# Altium schematic sheet PortSwitch.SchDoc
size A4; DocumentNumber: 1; SheetNumber: 5; SheetTotal: 7
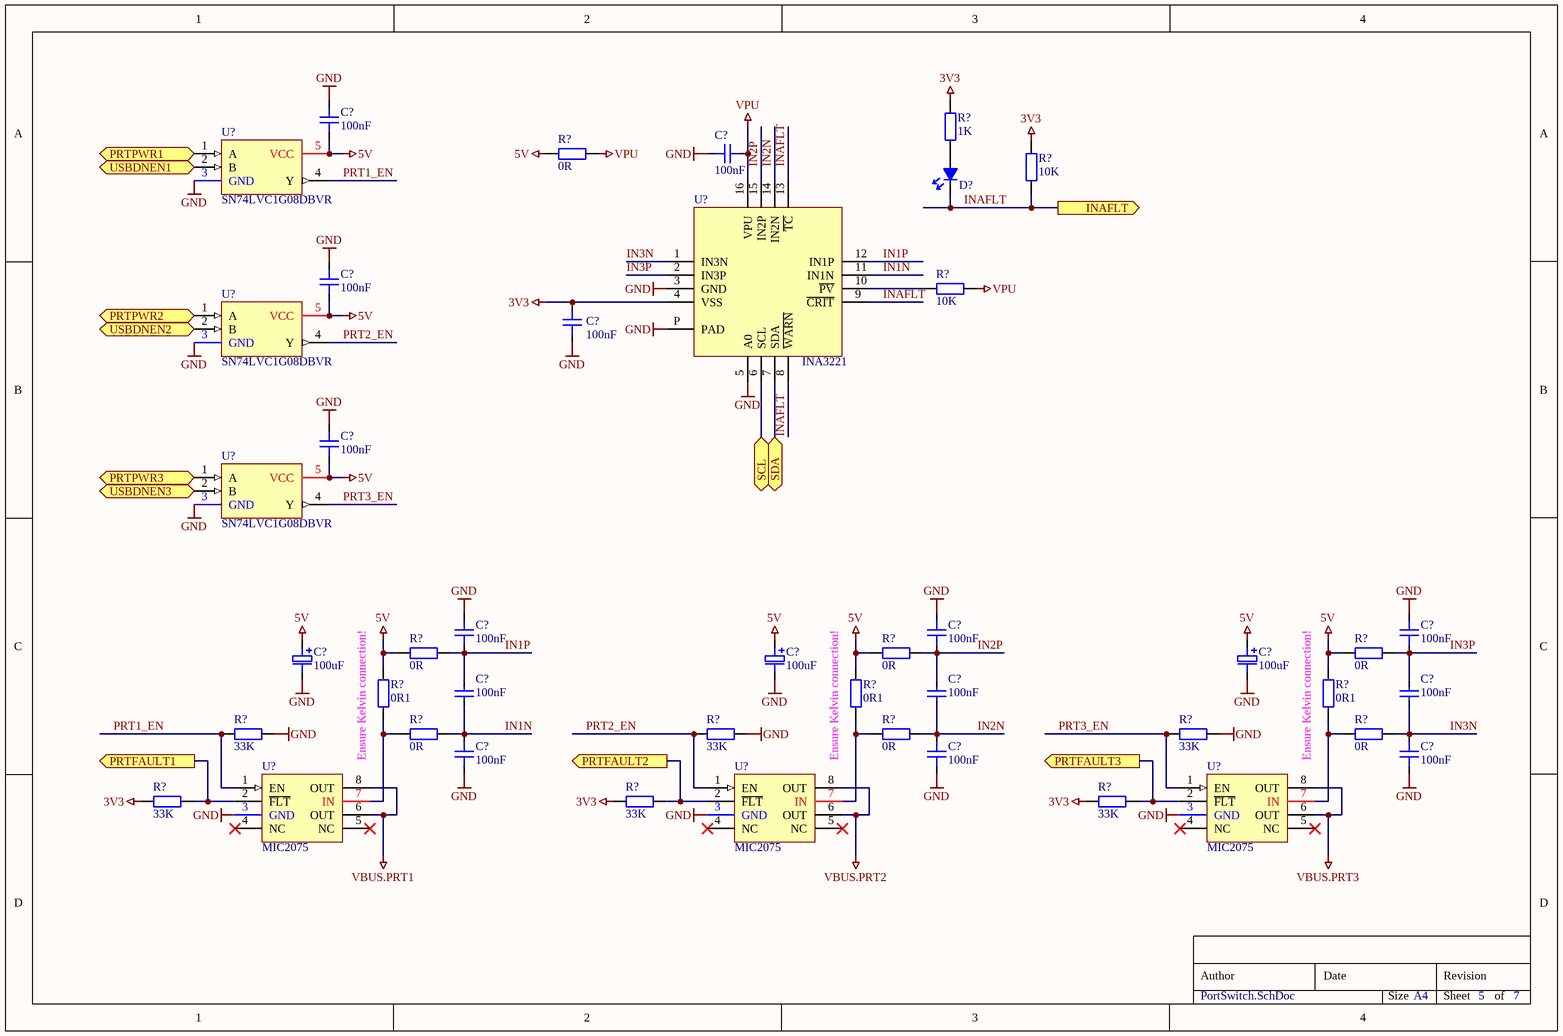
[diagram p0: PortSwitch.SchDoc]

## Parts
(Parts that share a designator on the sheet are numbered #1, #2 ... from top to bottom, then left to right.)
C?#1  100nF  [0603C_RF_M]
C?#2  100nF  [0603C_RF_M]
C?#3  100nF  [0603C_RF_M]
C?#4  100nF  [0603C_RF_M]
C?#5  100nF  [0603C_RF_M]
C?#6  100nF  [0603C_RF_M]
C?#7  100nF  [0603C_RF_M]
C?#8  100nF  [0603C_RF_M]
C?#9  100uF  [C_EL_B_4MM_RF_M]
C?#10  100uF  [C_EL_B_4MM_RF_M]
C?#11  100uF  [C_EL_B_4MM_RF_M]
C?#12  100nF  [0603C_RF_M]
C?#13  100nF  [0603C_RF_M]
C?#14  100nF  [0603C_RF_M]
C?#15  100nF  [0603C_RF_M]
C?#16  100nF  [0603C_RF_M]
C?#17  100nF  [0603C_RF_M]
D?  Unspecified  [0805LED_RF_M]  (value not drawn)
R?#1  10K  [0603R_RF_M]
R?#2  0R  [0603R_RF_M]
R?#3  1K  [0603R_RF_M]
R?#4  10K  [0603R_RF_M]
R?#5  0R  [0603R_RF_M]
R?#6  0R  [0603R_RF_M]
R?#7  0R  [0603R_RF_M]
R?#8  0R1  [0603R_RF_M]
R?#9  0R1  [0603R_RF_M]
R?#10  0R1  [0603R_RF_M]
R?#11  33K  [0603R_RF_M]
R?#12  0R  [0603R_RF_M]
R?#13  33K  [0603R_RF_M]
R?#14  0R  [0603R_RF_M]
R?#15  33K  [0603R_RF_M]
R?#16  0R  [0603R_RF_M]
R?#17  33K  [0603R_RF_M]
R?#18  33K  [0603R_RF_M]
R?#19  33K  [0603R_RF_M]
U?#1  SN74LVC1G08DBVR  [TI_SOT-23-5]
U?#2  INA3221  [TI_QFN-16_RF_M]
U?#3  SN74LVC1G08DBVR  [TI_SOT-23-5]
U?#4  SN74LVC1G08DBVR  [TI_SOT-23-5]
U?#5  MIC2075  [SOIC-8]
U?#6  MIC2075  [SOIC-8]
U?#7  MIC2075  [SOIC-8]

## Ports
INAFLT (out), PRTFAULT1 (out), PRTFAULT2 (out), PRTFAULT3 (out), PRTPWR1 (in), PRTPWR2 (in), PRTPWR3 (in), SCL (bidir), SDA (bidir), USBDNEN1 (in), USBDNEN2 (in), USBDNEN3 (in)

## Nets
3V3: C?#4.2 R?#1.1 R?#3.2 R?#17.1 R?#18.1 R?#19.1 U?#2.4(VSS)
5V: C?#1.2 C?#3.2 C?#5.2 C?#9.P C?#10.P C?#11.P R?#2.1 R?#5.1 R?#6.1 R?#7.1 R?#8.2 R?#9.2 R?#10.2 U?#1.5(VCC) U?#3.5(VCC) U?#4.5(VCC)
GND: C?#1.1 C?#2.1 C?#3.1 C?#4.1 C?#5.1 C?#6.2 C?#7.2 C?#8.2 C?#9.N C?#10.N C?#11.N C?#15.1 C?#16.1 C?#17.1 R?#11.1 R?#13.1 R?#15.1 U?#1.3(GND) U?#2.3(GND) U?#2.5(A0) U?#2.P(PAD) U?#3.3(GND) U?#4.3(GND) U?#5.3(GND) U?#6.3(GND) U?#7.3(GND)
VBUS.PRT1: U?#5.6(OUT) U?#5.8(OUT)
VBUS.PRT2: U?#6.6(OUT) U?#6.8(OUT)
VBUS.PRT3: U?#7.6(OUT) U?#7.8(OUT)
VPU: C?#2.2 R?#2.2 R?#4.1 U?#2.16(VPU)
IN1N: C?#12.1 C?#15.2 R?#12.2 U?#2.11(IN1N)
IN1P: C?#6.1 C?#12.2 R?#5.2 U?#2.12(IN1P)
IN2N: C?#13.1 C?#16.2 R?#14.2 U?#2.14(IN2N)
IN2P: C?#7.1 C?#13.2 R?#6.2 U?#2.15(IN2P)
IN3N: C?#14.1 C?#17.2 R?#16.2 U?#2.1(IN3N)
IN3P: C?#8.1 C?#14.2 R?#7.2 U?#2.2(IN3P)
INAFLT: D?.C R?#1.2 U?#2.8(~{WARN}) U?#2.9(~{CRIT}) U?#2.13(~{TC}) ; port INAFLT
PRT1_EN: R?#11.2 U?#1.4(Y) U?#5.1(EN)
PRT2_EN: R?#13.2 U?#3.4(Y) U?#6.1(EN)
PRT3_EN: R?#15.2 U?#4.4(Y) U?#7.1(EN)
PRTFAULT1: R?#17.2 U?#5.2(~{FLT}) ; port PRTFAULT1
PRTFAULT2: R?#18.2 U?#6.2(~{FLT}) ; port PRTFAULT2
PRTFAULT3: R?#19.2 U?#7.2(~{FLT}) ; port PRTFAULT3
PRTPWR1: U?#1.1(A) ; port PRTPWR1
PRTPWR2: U?#3.1(A) ; port PRTPWR2
PRTPWR3: U?#4.1(A) ; port PRTPWR3
SCL: U?#2.6(SCL) ; port SCL
SDA: U?#2.7(SDA) ; port SDA
USBDNEN1: U?#1.2(B) ; port USBDNEN1
USBDNEN2: U?#3.2(B) ; port USBDNEN2
USBDNEN3: U?#4.2(B) ; port USBDNEN3
NetD?_A: D?.A R?#3.1
NetR?#4_2: R?#4.2 U?#2.10(~{PV})
NetR?#8_1: R?#8.1 R?#12.1 U?#5.7(IN)
NetR?#9_1: R?#9.1 R?#14.1 U?#6.7(IN)
NetR?#10_1: R?#10.1 R?#16.1 U?#7.7(IN)

Not connected (* = marked no-connect by the designer): U?#5 4(NC)* 5(NC)*; U?#6 4(NC)* 5(NC)*; U?#7 4(NC)* 5(NC)*

## Notes on the sheet
- (near R?#8) Ensure Kelvin connection!
- (near R?#9) Ensure Kelvin connection!
- (near R?#10) Ensure Kelvin connection!
- Author
- Date
- Revision
- Size
- A4
- Sheet
- of

## Library data of the parts
C?#1-C?#8 C?#12-C?#17 = C: Capacitor; Manufacturer: Generic Brand; Max Voltage: ? V; Value: 100nF; Tolerance: ?; Manufacturer Part No: *; Supplier: *; Supplier Link: http://; Supplier Part No: *; Category: Capacitor; Mounting Technology: SMT
  C?#6-C?#8 C?#12-C?#17: Tag: *
C?#9-C?#11 = C-P: Polarized Capacitor; Manufacturer: Generic Brand; Max Voltage: ? V; Value: 100uF; Mounting Technology: SMT; Tolerance: ?; Tag: *; Manufacturer Part No: *; Supplier: *; Supplier Link: http://; Supplier Part No: *; Category: Capacitor
D? = LED: Manufacturer: Generic Brand; Forward Voltage Drop: ? V; Emitting Color: Unspecified; Manufacturer Part No: *; Supplier: *; Supplier Link: http://; Supplier Part No: *; Category: Diode; Mounting Technology: SMT
R?#1-R?#19 = R: Resistor; Manufacturer: Generic Brand; Power Rating: ? W; Max Voltage: ? V; Tolerance: ?; Supplier Link: http://; Category: Resistor; Mounting Technology: SMT
  R?#1 R?#4: Value: 10K
  R?#2 R?#5-R?#7 R?#12 R?#14 R?#16: Value: 0R
  R?#3: Value: 1K
  R?#8-R?#10: Value: 0R1
  R?#11 R?#13 R?#15 R?#17-R?#19: Value: 33K
U?#1 U?#3 U?#4 = SN74LVC1G08DBVR: IC GATE AND 1CH 2-INP SOT23-5; Manufacturer: Texas Instruments; Supply Voltage: 1.65V~5.5V; Product Number: SN74LVC1G08DBVR; Supplier: DigiKey; Supplier Link: https://www.digikey.com/en/products/detail/texas-instruments/SN74LVC1G08DBVR/385718; Supplier Part No: 296-11601-1-ND; Mounting Technology: SMT; Package: SOT-23-5; Alternative Supplier: Chipdip; Alternative Supplier Link: https://www.chipdip.by/product/sn74lvc1g08dbvr-2; Alternative Supplier Part No: 9000043235
U?#2 = INA3221: IC CURRENT SHUNT MONITOR 16VQFN; Manufacturer: Texas Instruments; Supplier: DigiKey; Supplier Part No: 296-INA3221AIRGVRCT-ND; Supplier Link: https://www.digikey.com/en/products/detail/texas-instruments/INA3221AIRGVR/3588826; Mounting Technology: SMT; Package: VQFN-16; Category: IC
U?#5-U?#7 = MIC2075: IC PWR SWITCH N-CHAN 1:1 500MA; Manufacturer: Microchip Technology; Product Number: MIC2075-2YM-TR; Supplier: DigiKey; Supplier Link: https://www.digikey.com/en/products/detail/microchip-technology/MIC2075-2YM-TR/1616766; Supplier Part No: MIC2075-2YM-CT-ND; Mounting Technology: SMT; Package: SOIC-8; Category: IC